# Altium project FMC_Delay_1ns_4Cha.PrjPcb (part 1 of 2)
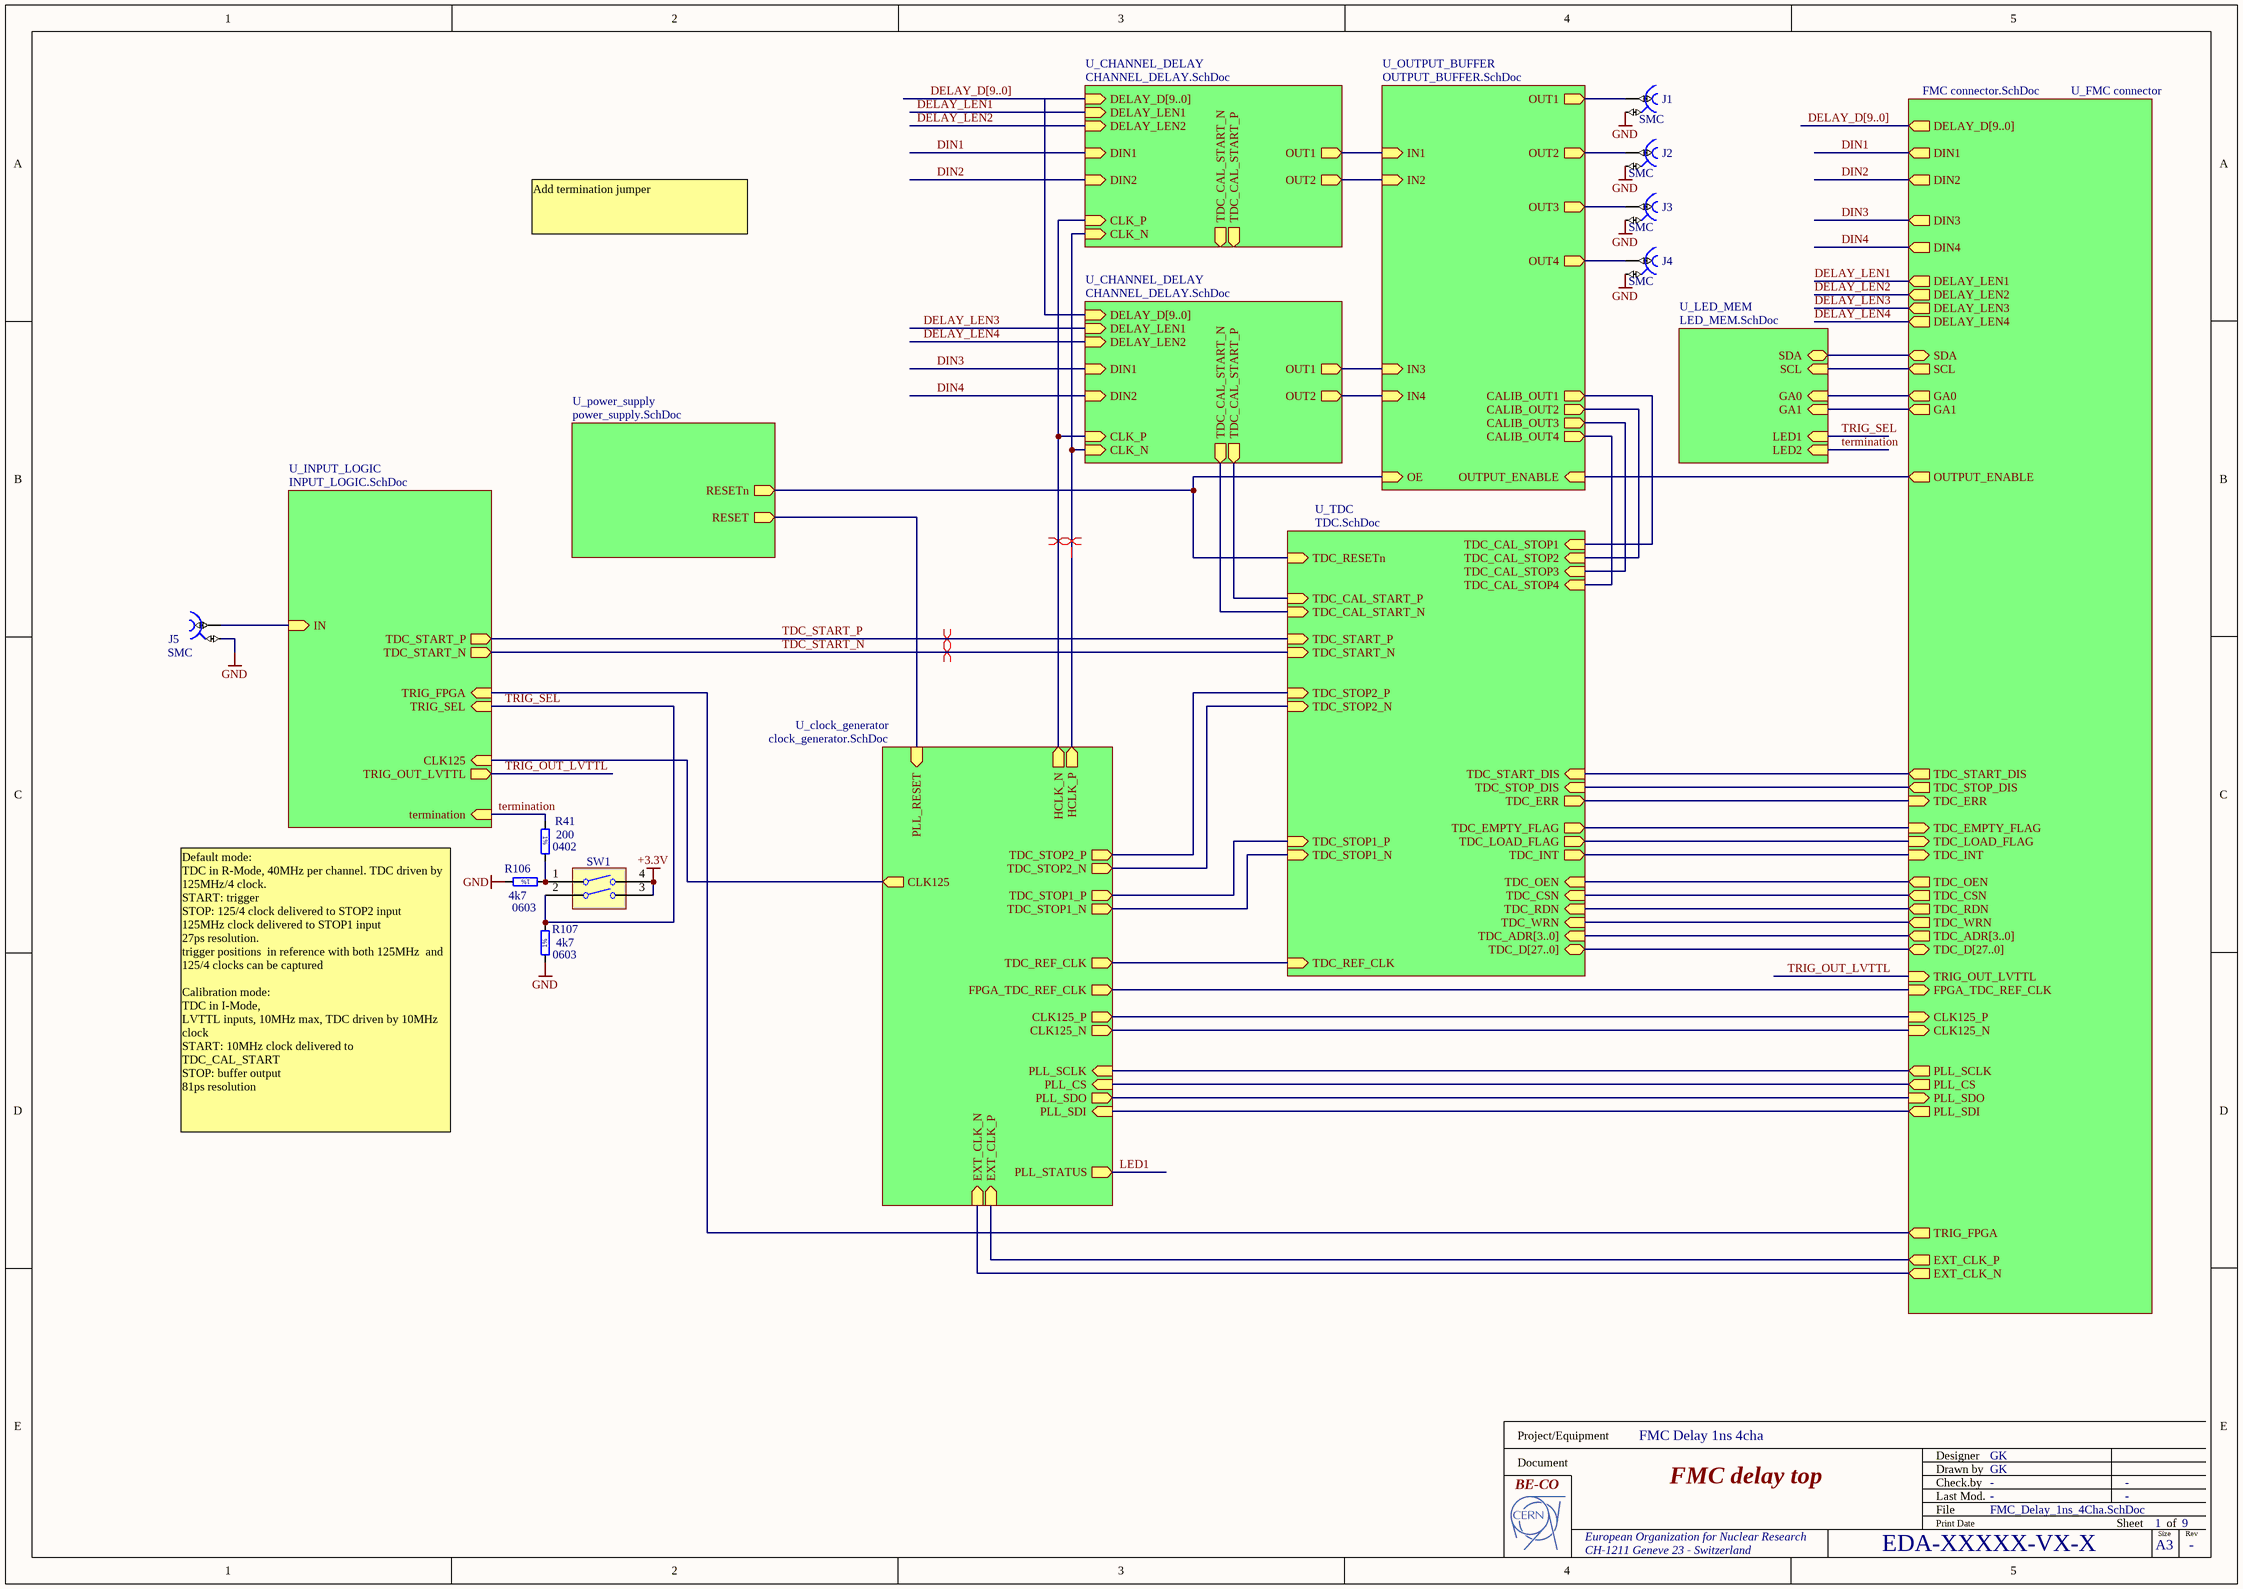
[diagram p0: FMC_Delay_1ns_4Cha.SchDoc]
6 sheets, 229 parts. Net scope: hierarchical (ports join the sheet entries above them; power ports are global).
Board file: FMC_Delay_1ns_4Cha.PcbDoc
Sheets:
  FMC_Delay_1ns_4Cha.SchDoc
    U_clock_generator = clock_generator.SchDoc
    U_FMC connector = FMC connector.SchDoc
    U_TDC = TDC.SchDoc
    U_CHANNEL_DELAY = CHANNEL_DELAY.SchDoc
    U_CHANNEL_DELAY = CHANNEL_DELAY.SchDoc
    U_INPUT_LOGIC = INPUT_LOGIC.SchDoc

## Sheet FMC_Delay_1ns_4Cha.SchDoc: FMC Delay Top
size 420 x 297 mm; CheckedBy: -; CompanyName: CERN; DrawnBy: GK; Organization: CERN; Address1: European Organization for Nuclear Research; Address2: CH-1211 Geneve 23 - Switzerland; Revision: -; SheetNumber: 1; SheetTotal: 9; EDA_Number: EDA-XXXXX-VX-X; Projet: FMC Delay 1ns 4cha; ModifiedBy: -; CheckedDate: -; DivGrp: BE-CO; Designer: GK; ModifiedDate: -; ProjectName: FMC Delay 1ns 4cha

### Parts
J1  SMC  [JOHNSON_131-6701-341]
J2  SMC  [JOHNSON_131-6701-341]
J3  SMC  [JOHNSON_131-6701-341]
J4  SMC  [JOHNSON_131-6701-341]
J5  SMC  [JOHNSON_131-6701-341]
R41  200  Case: 0402  [RESC1005X40N]
R106  4k7  Case: 0603  [RESC1608X55N]
R107  4k7  Case: 0603  [RESC1608X55N]
SW1  Switch  [SW_TYCO_1571983-1]  (value not drawn)

### Sub-sheets
U_CHANNEL_DELAY = CHANNEL_DELAY.SchDoc: DELAY_D[9..0] (in), DELAY_LEN1 (in), DELAY_LEN2 (in), DIN1 (in), DIN2 (in), CLK_N (in), CLK_P (in), OUT1 (out), OUT2 (out), TDC_CAL_START_P (out), TDC_CAL_START_N (out)
U_CHANNEL_DELAY = CHANNEL_DELAY.SchDoc: DELAY_D[9..0] (in), DELAY_LEN1 (in), DELAY_LEN2 (in), DIN1 (in), DIN2 (in), CLK_N (in), CLK_P (in), OUT1 (out), OUT2 (out), TDC_CAL_START_P (out), TDC_CAL_START_N (out)
U_clock_generator = clock_generator.SchDoc: EXT_CLK_N (in), EXT_CLK_P (in), HCLK_P (out), HCLK_N (out), PLL_CS (in), PLL_SCLK (in), PLL_SDO (out), PLL_RESET (in), PLL_SDI (in), TDC_REF_CLK (out), TDC_STOP2_P (out), TDC_STOP2_N (out), TDC_STOP1_P (out), TDC_STOP1_N (out), CLK125_N (out), CLK125_P (out), CLK125 (out), FPGA_TDC_REF_CLK (out), PLL_STATUS (out)
U_FMC connector = FMC connector.SchDoc: DIN1 (out), DIN2 (out), DIN3 (out), DIN4 (out), EXT_CLK_P (out), EXT_CLK_N (out), SDA (bidir), SCL (out), GA0 (out), GA1 (out), TDC_START_DIS (out), TDC_STOP_DIS (out), TDC_EMPTY_FLAG (in), TDC_LOAD_FLAG (in), TDC_INT (in), TDC_OEN (out), TDC_CSN (out), TDC_RDN (out), TDC_WRN (out), TDC_ADR[3..0] (out), TDC_D[27..0] (bidir), DELAY_LEN1 (out), DELAY_LEN2 (out), DELAY_LEN3 (out), DELAY_LEN4 (out), PLL_SCLK (out), PLL_CS (out), PLL_SDO (in), PLL_SDI (out), CLK125_P (in), CLK125_N (in), FPGA_TDC_REF_CLK (in), TRIG_OUT_LVTTL (in), DELAY_D[9..0] (out), TDC_ERR (in), OUTPUT_ENABLE (out), TRIG_FPGA (out)
U_INPUT_LOGIC = INPUT_LOGIC.SchDoc: TDC_START_N (out), TDC_START_P (out), IN (in), termination (in), CLK125 (in), TRIG_OUT_LVTTL (out), TRIG_FPGA (in), TRIG_SEL (in)
U_LED_MEM = LED_MEM.SchDoc (file not in this document): SDA (bidir), SCL (in), GA0 (in), GA1 (in), LED1 (in), LED2 (in)
U_OUTPUT_BUFFER = OUTPUT_BUFFER.SchDoc (file not in this document): IN1 (in), IN2 (in), IN3 (in), IN4 (in), OUT1 (out), OUT2 (out), OUT3 (out), OUT4 (out), OE (in), CALIB_OUT1 (out), CALIB_OUT2 (out), CALIB_OUT3 (out), CALIB_OUT4 (out), OUTPUT_ENABLE (in)
U_power_supply = power_supply.SchDoc (file not in this document): RESET (out), RESETn (out)
U_TDC = TDC.SchDoc: TDC_ADR[3..0] (in), TDC_START_P (in), TDC_START_N (in), TDC_STOP1_P (in), TDC_STOP1_N (in), TDC_STOP2_P (in), TDC_STOP2_N (in), TDC_CAL_STOP1 (in), TDC_CAL_STOP2 (in), TDC_CAL_STOP3 (in), TDC_CAL_STOP4 (in), TDC_START_DIS (in), TDC_STOP_DIS (in), TDC_EMPTY_FLAG (out), TDC_LOAD_FLAG (out), TDC_INT (out), TDC_REF_CLK (in), TDC_RESETn (in), TDC_D[27..0] (bidir), TDC_OEN (in), TDC_CSN (in), TDC_RDN (in), TDC_WRN (in), TDC_CAL_START_N (in), TDC_CAL_START_P (in), TDC_ERR (out)

### Nets
+3.3V: SW1.3 SW1.4
GND: J1.2 J2.2 J3.2 J4.2 J5.2 R106.2 R107.1
CLK125_N: sheet U_clock_generator/CLK125_N, sheet U_FMC connector/CLK125_N
CLK125_P: sheet U_clock_generator/CLK125_P, sheet U_FMC connector/CLK125_P
DELAY_LEN1: sheet U_FMC connector/DELAY_LEN1, sheet U_CHANNEL_DELAY/DELAY_LEN1
DELAY_LEN2: sheet U_FMC connector/DELAY_LEN2, sheet U_CHANNEL_DELAY/DELAY_LEN2
DELAY_LEN3: sheet U_FMC connector/DELAY_LEN3, sheet U_CHANNEL_DELAY/DELAY_LEN1
DELAY_LEN4: sheet U_FMC connector/DELAY_LEN4, sheet U_CHANNEL_DELAY/DELAY_LEN2
DIN1: sheet U_FMC connector/DIN1, sheet U_CHANNEL_DELAY/DIN1
DIN2: sheet U_FMC connector/DIN2, sheet U_CHANNEL_DELAY/DIN2
DIN3: sheet U_FMC connector/DIN3, sheet U_CHANNEL_DELAY/DIN1
DIN4: sheet U_FMC connector/DIN4, sheet U_CHANNEL_DELAY/DIN2
EXT_CLK_N: sheet U_clock_generator/EXT_CLK_N, sheet U_FMC connector/EXT_CLK_N
EXT_CLK_P: sheet U_clock_generator/EXT_CLK_P, sheet U_FMC connector/EXT_CLK_P
GA0: sheet U_FMC connector/GA0, sheet U_LED_MEM/GA0
GA1: sheet U_FMC connector/GA1, sheet U_LED_MEM/GA1
LED1: sheet U_clock_generator/PLL_STATUS
SCL: sheet U_FMC connector/SCL, sheet U_LED_MEM/SCL
SDA: sheet U_FMC connector/SDA, sheet U_LED_MEM/SDA
TDC_CAL_STOP1: sheet U_TDC/TDC_CAL_STOP1, sheet U_OUTPUT_BUFFER/CALIB_OUT1
TDC_CAL_STOP2: sheet U_TDC/TDC_CAL_STOP2, sheet U_OUTPUT_BUFFER/CALIB_OUT2
TDC_CAL_STOP3: sheet U_TDC/TDC_CAL_STOP3, sheet U_OUTPUT_BUFFER/CALIB_OUT3
TDC_CAL_STOP4: sheet U_TDC/TDC_CAL_STOP4, sheet U_OUTPUT_BUFFER/CALIB_OUT4
TDC_START_N: sheet U_TDC/TDC_START_N, sheet U_INPUT_LOGIC/TDC_START_N
TDC_START_P: sheet U_TDC/TDC_START_P, sheet U_INPUT_LOGIC/TDC_START_P
TDC_STOP1_N: sheet U_clock_generator/TDC_STOP1_N, sheet U_TDC/TDC_STOP1_N
TDC_STOP1_P: sheet U_clock_generator/TDC_STOP1_P, sheet U_TDC/TDC_STOP1_P
TDC_STOP2_N: sheet U_clock_generator/TDC_STOP2_N, sheet U_TDC/TDC_STOP2_N
TDC_STOP2_P: sheet U_clock_generator/TDC_STOP2_P, sheet U_TDC/TDC_STOP2_P
termination: R41.1 ; sheet U_LED_MEM/LED2, sheet U_INPUT_LOGIC/termination
TRIG_OUT_LVTTL: sheet U_FMC connector/TRIG_OUT_LVTTL, sheet U_INPUT_LOGIC/TRIG_OUT_LVTTL
TRIG_SEL: R107.2 SW1.2 ; sheet U_LED_MEM/LED1, sheet U_INPUT_LOGIC/TRIG_SEL
NetF4_1: J5.1 ; sheet U_INPUT_LOGIC/IN
NetIC1A_6: sheet U_CHANNEL_DELAY/OUT2, sheet U_OUTPUT_BUFFER/IN2
NetIC1A_7: sheet U_CHANNEL_DELAY/OUT1, sheet U_OUTPUT_BUFFER/IN1
NetIC1B_6: sheet U_CHANNEL_DELAY/OUT2, sheet U_OUTPUT_BUFFER/IN4
NetIC1B_7: sheet U_CHANNEL_DELAY/OUT1, sheet U_OUTPUT_BUFFER/IN3
NetIC2B_4: sheet U_TDC/TDC_CAL_START_P, sheet U_CHANNEL_DELAY/TDC_CAL_START_P
NetIC2B_5: sheet U_TDC/TDC_CAL_START_N, sheet U_CHANNEL_DELAY/TDC_CAL_START_N
NetIC3A_3: sheet U_clock_generator/HCLK_N, sheet U_CHANNEL_DELAY/CLK_P, sheet U_CHANNEL_DELAY/CLK_P
NetIC3A_4: sheet U_clock_generator/HCLK_P, sheet U_CHANNEL_DELAY/CLK_N, sheet U_CHANNEL_DELAY/CLK_N
NetIC4_16: sheet U_clock_generator/PLL_SCLK, sheet U_FMC connector/PLL_SCLK
NetIC4_17: sheet U_clock_generator/PLL_CS, sheet U_FMC connector/PLL_CS
NetIC4_22: sheet U_clock_generator/PLL_SDI, sheet U_FMC connector/PLL_SDI
NetIC4_23: sheet U_clock_generator/PLL_RESET, sheet U_power_supply/RESET
NetIC4_33: sheet U_clock_generator/CLK125, sheet U_INPUT_LOGIC/CLK125
NetIC4_35: sheet U_clock_generator/TDC_REF_CLK, sheet U_TDC/TDC_REF_CLK
NetIC4_36: sheet U_clock_generator/FPGA_TDC_REF_CLK, sheet U_FMC connector/FPGA_TDC_REF_CLK
NetIC8_4: sheet U_FMC connector/TDC_START_DIS, sheet U_TDC/TDC_START_DIS
NetIC8_5: sheet U_FMC connector/TDC_STOP_DIS, sheet U_TDC/TDC_STOP_DIS
NetIC8_13: sheet U_FMC connector/TDC_WRN, sheet U_TDC/TDC_WRN
NetIC8_14: sheet U_FMC connector/TDC_CSN, sheet U_TDC/TDC_CSN
NetIC8_15: sheet U_FMC connector/TDC_RDN, sheet U_TDC/TDC_RDN
NetIC8_63: sheet U_FMC connector/TDC_OEN, sheet U_TDC/TDC_OEN
NetIC8_67: sheet U_power_supply/RESETn, sheet U_TDC/TDC_RESETn, sheet U_OUTPUT_BUFFER/OE
NetIC17_1: sheet U_FMC connector/TRIG_FPGA, sheet U_INPUT_LOGIC/TRIG_FPGA
NetJ1_1: J1.1 ; sheet U_OUTPUT_BUFFER/OUT1
NetJ2_1: J2.1 ; sheet U_OUTPUT_BUFFER/OUT2
NetJ3_1: J3.1 ; sheet U_OUTPUT_BUFFER/OUT3
NetJ4_1: J4.1 ; sheet U_OUTPUT_BUFFER/OUT4
NetJ6_d15: sheet U_FMC connector/OUTPUT_ENABLE, sheet U_OUTPUT_BUFFER/OUTPUT_ENABLE
NetJ6_d18: sheet U_clock_generator/PLL_SDO, sheet U_FMC connector/PLL_SDO
NetJ6_h26: sheet U_FMC connector/TDC_LOAD_FLAG, sheet U_TDC/TDC_LOAD_FLAG
NetJ6_h28: sheet U_FMC connector/TDC_EMPTY_FLAG, sheet U_TDC/TDC_EMPTY_FLAG
NetJ6_h31: sheet U_FMC connector/TDC_INT, sheet U_TDC/TDC_INT
NetJ6_h32: sheet U_FMC connector/TDC_ERR, sheet U_TDC/TDC_ERR
NetR41_2: R41.2 R106.1 SW1.1

### Buses and harness runs
bus DELAY_D[9..0] = sheet U_CHANNEL_DELAY/DELAY_D[9..0]
bus DELAY_D[9..0] = sheet U_FMC connector/DELAY_D[9..0]
bus sheet U_FMC connector/TDC_ADR[3..0] = sheet U_TDC/TDC_ADR[3..0]
bus sheet U_FMC connector/TDC_D[27..0] = sheet U_TDC/TDC_D[27..0]

### Layout directives
differential pair: NetIC3A_3, NetIC3A_4, TDC_START_N, TDC_START_P

### Notes on the sheet
- Add termination jumper
- Default mode:
  TDC in R-Mode, 40MHz per channel. TDC driven by 125MHz/4 clock.
  START: trigger
  STOP: 125/4 clock delivered to STOP2 input
  125MHz clock delivered to STOP1 input
  27ps resolution.
  trigger positions  in reference with both 125MHz  and 125/4 clocks can be captured
  Calibration mode:
  TDC in I-Mode,
  LVTTL inputs, 10MHz max, TDC driven by 10MHz clock
  START: 10MHz clock delivered to TDC_CAL_START
  STOP: buffer output
  81ps resolution
- Project/Equipment
- Document
- FMC delay top
- Designer
- Drawn by
- Check.by
- File
- Last Mod.
- Print Date
- Sheet
- Size
- A3
- of
- Rev
- (in symbol R0402_200R_1%_0.0625W_100PPM) 1%
- (in symbol R0603_4K7_1%_0.1W_100PPM) 1%

### Library data of the parts
J1-J5 = JOHNSON_131-6701-341: Part Description: SMC 50 Ohm Right Angle Bulkhead Jack Receptacle; Manufacturer Part Number: 142-0701-873; Table: Miscellaneous; Part Number: JOHNSON_131-6701-341; Component Kind: Standard; Component Type: Standard; Pin Count: 2; Family: SMC; Mounted: Yes; Socket: No; SMD: No; Status: None; Manufacturer: JOHNSON; ComponentHeight: 7.67mm; HelpURL: \\cern.ch\dfs\Applications\Altium\Datasheets\JOHNSON_131-6701-341.pdf; Author: CERN DEM JLC; CreateDate: 16.02.2010; LatestRevisionDate: 16.02.2010
R41 = R0402_200R_1%_0.0625W_100PPM: Resistor - 1%; Part Description: General Purpose Thick Film Chip Resistor; Manufacturer: GENERIC; Manufacturer1 Part Number: 232270672001; TC: ±100ppm/°C; Table: Resistors SMD; Part Number: R0402_200R_1%_0.0625W_100PPM; Component Kind: Standard; Component Type: Standard; Pin Count: 2; Value: 200; Status: Not recommended; Power: 0.0625W; Tolerance: ±1%; Manufacturer Part Number: R0402_200R_1%_0.0625W_100PPM; Mounted: Yes; Socket: No; SMD: Yes; Manufacturer1 Example: PHYCOMP; Manufacturer1 ComponentHeight: 0.4mm; HelpURL: \\cern.ch\dfs\Applications\Altium\Datasheets\R0402_Phycomp_RC0402.pdf; Author: CERN DEM JLC; CreateDate: 12/3/2007; LatestRevisionDate: 3/13/2008
R106 R107 = R0603_4K7_1%_0.1W_100PPM: Resistor - 1%; Part Description: General Purpose Thick Film Chip Resistor; Manufacturer: GENERIC; Manufacturer1 Part Number: NRC06F4701TRF; Power: 0.1W; TC: ±100ppm/°C; Table: Resistors SMD; Part Number: R0603_4K7_1%_0.1W_100PPM; Component Kind: Standard; Component Type: Standard; Pin Count: 2; Value: 4k7; Status: Preferred; Tolerance: ±1%; Manufacturer Part Number: R0603_4K7_1%_0.1W_100PPM; Mounted: Yes; Socket: No; SMD: Yes; Manufacturer1 Example: NIC COMPONENT; Manufacturer1 ComponentHeight: 0.55mm; HelpURL: \\cern.ch\dfs\Applications\Altium\Datasheets\R0603_NIC_NRC.pdf; Author: CERN DEM JLC; CreateDate: 2007-12-03; LatestRevisionDate: 2008-03-13
SW1 = SW_TYCO_1571983-1: 2 Ways SPST DIP Switch; Part Description: 2 Way SPST SMD DIP Switch, Latched, Contact Rating 0.025A 24VDC; Manufacturer: TYCO; Manufacturer Part Number: 1571983-1 or GDH02S04; Table: Switches; Part Number: SW_TYCO_1571983-1; Component Kind: Standard; Component Type: Standard; Pin Count: 4; PackageDescription: Pitch 1.27mm,  Body3.66x6.2mm, 2 Ways SPST Surface-Mount DIP Switch, TYCO GDH Serie; Family: Switch; Mounted: Yes; Socket: No; SMD: Yes; Status: None; ComponentHeight: 2.31mm; HelpURL: \\cern.ch\dfs\Applications\Altium\Datasheets\SW_TYCO_1571983-1.pdf; Author: CERN DEM JLC; CreateDate: 2009-01-08; LatestRevisionDate: 2009-01-08

## Sheet clock_generator.SchDoc: ADC clock generator
size 297 x 209 mm; CheckedBy: -; CompanyName: CERN; Organization: CERN; Address1: European Organization for Nuclear Research; Address2: CH-1211 Geneve 23 - Switzerland; DocumentNumber: 5; Revision: -; SheetNumber: 2; SheetTotal: 9; EDA_Number: EDA-XXXXX-VX-X; Projet: FMC Delay 1ns 4cha; ModifiedBy: -; CheckedDate: -; DivGrp: BE-CO; Designer: GK; ModifiedDate: -
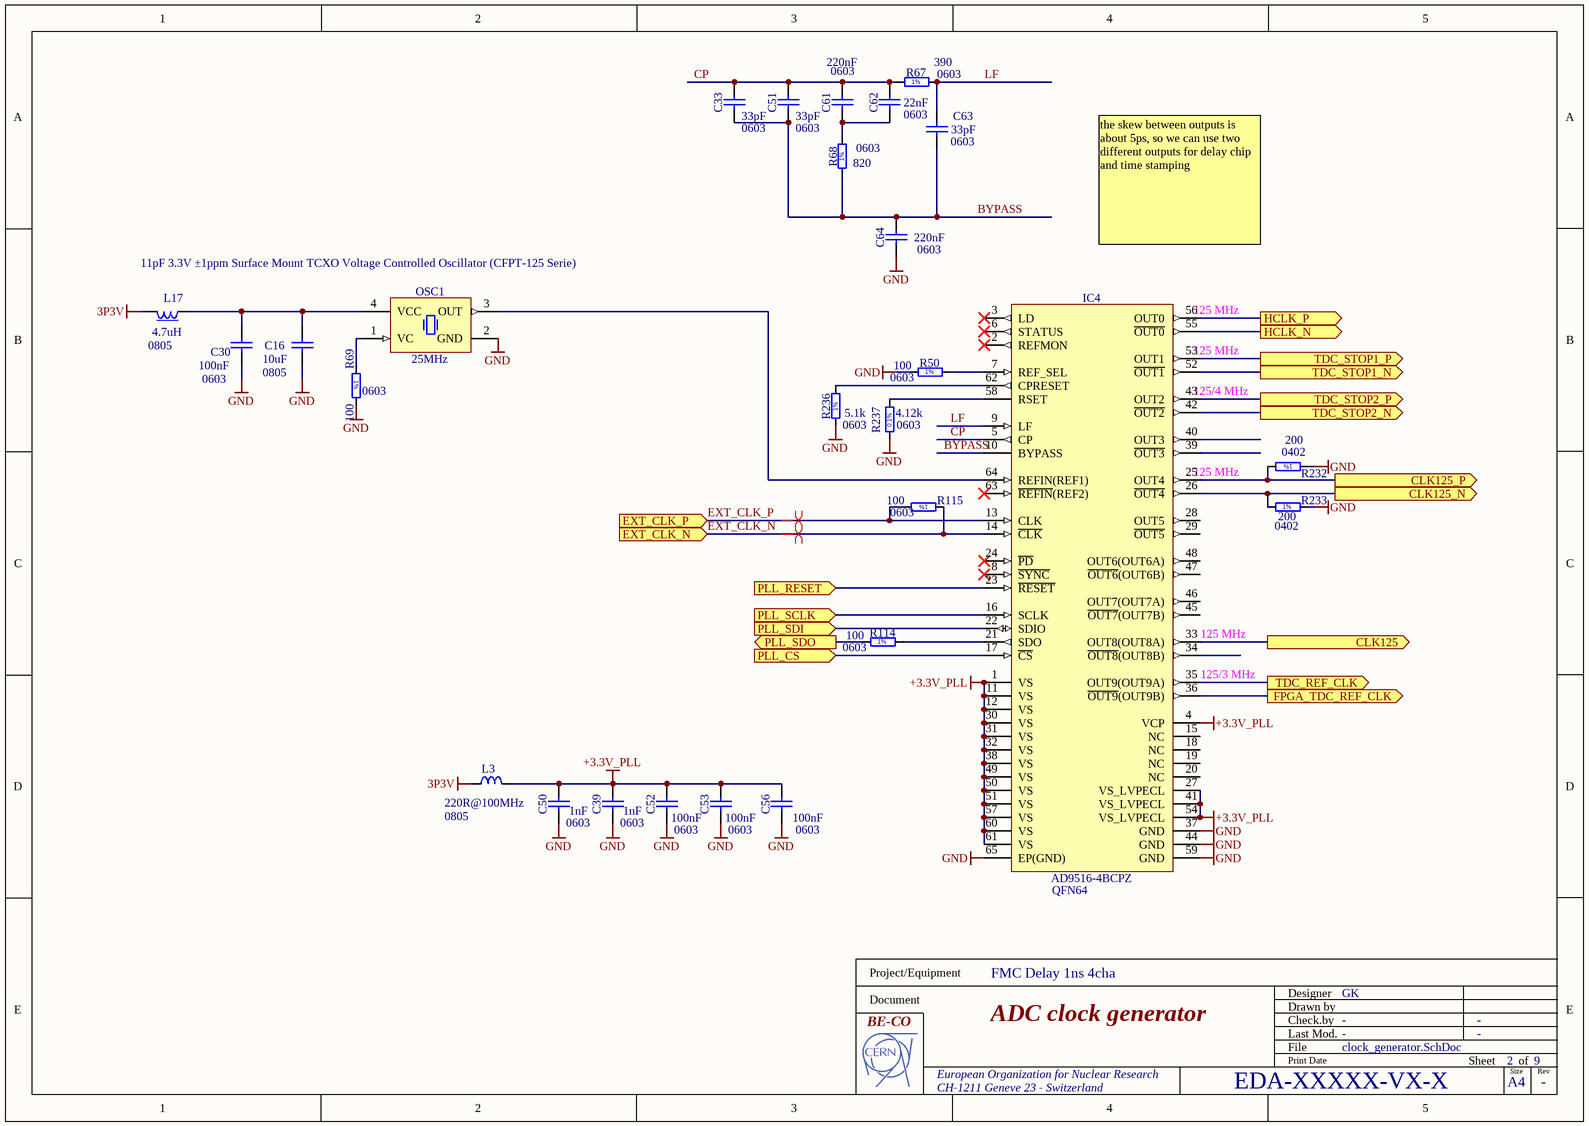
[diagram p1: clock_generator.SchDoc]

### Parts
C16  10uF  Case: 0805  [CAPC2012X135N]
C30  100nF  Case: 0603  [CAPC1608X87N]
C33  33pF  Case: 0603  [CAPC1608X87N]
C39  1nF  Case: 0603  [CAPC1608X87N]
C50  1nF  Case: 0603  [CAPC1608X87N]
C51  33pF  Case: 0603  [CAPC1608X87N]
C52  100nF  Case: 0603  [CAPC1608X87N]
C53  100nF  Case: 0603  [CAPC1608X87N]
C56  100nF  Case: 0603  [CAPC1608X87N]
C61  220nF  Case: 0603  [CAPC1608X87N]
C62  22nF  Case: 0603  [CAPC1608X87N]
C63  33pF  Case: 0603  [CAPC1608X87N]
C64  220nF  Case: 0603  [CAPC1608X87N]
IC4  AD9516-4BCPZ  Case: QFN64  [QFN50P900X900X100-65N-S635]
L3  220R@100MHz  Case: 0805  [INDC2012X105N]
L17  4.7uH  Case: 0805  [INDC2012X145N]
OSC1  25MHz  Part Description: 11pF 3.3V ±1ppm Surface Mount TCXO Voltage Controlled Oscillator (CFPT-125 Serie)  [OSC_RAKON_IVT3200C]
R50  100  Case: 0603  [RESC1608X55N]
R67  390  Case: 0603  [RESC1608X55N]
R68  820  Case: 0603  [RESC1608X55N]
R69  100  Case: 0603  [RESC1608X55N]
R114  100  Case: 0603  [RESC1608X55N]
R115  100  Case: 0603  [RESC1608X55N]
R232  200  Case: 0402  [RESC1005X40N]
R233  200  Case: 0402  [RESC1005X40N]
R236  5.1k  Case: 0603  [RESC1608X55N]
R237  4.12k  Case: 0603  [RESC1608X55N]

### Ports
CLK125 (out), CLK125_N (out), CLK125_P (out), EXT_CLK_N (in), EXT_CLK_P (in), FPGA_TDC_REF_CLK (out), HCLK_N (out), HCLK_P (out), PLL_CS (in), PLL_RESET (in), PLL_SCLK (in), PLL_SDI (in), PLL_SDO (out), TDC_REF_CLK (out), TDC_STOP1_N (out), TDC_STOP1_P (out), TDC_STOP2_N (out), TDC_STOP2_P (out)

### Nets
3P3V: L3.1 L17.2  [project net +3.3V]
+3.3V_PLL: C39.2 C50.2 C52.2 C53.2 C56.2 IC4.1(VS) IC4.4(VCP) IC4.11(VS) IC4.12(VS) IC4.27(VS_LVPECL) IC4.30(VS) IC4.31(VS) IC4.32(VS) IC4.38(VS) IC4.41(VS_LVPECL) IC4.49(VS) IC4.50(VS) IC4.51(VS) IC4.54(VS_LVPECL) IC4.57(VS) IC4.60(VS) IC4.61(VS) L3.2
GND: C16.1 C30.1 C39.1 C50.1 C52.1 C53.1 C56.1 C64.1 IC4.37(GND) IC4.44(GND) IC4.59(GND) IC4.65(EP(GND)) OSC1.2(GND) R50.1 R69.2 R232.1 R233.2 R236.1 R237.1
BYPASS: C33.1 C51.1 C63.1 C64.2 IC4.10(BYPASS) R68.1
CLK125_N: IC4.26(~{OUT4}) R233.1 ; port CLK125_N
CLK125_P: IC4.25(OUT4) R232.2 ; port CLK125_P
CP: C33.2 C51.2 C61.2 C62.2 IC4.5(CP) R67.1
EXT_CLK_N: IC4.14(~{CLK}) R115.1 ; port EXT_CLK_N
EXT_CLK_P: IC4.13(CLK) R115.2 ; port EXT_CLK_P
LF: C63.2 IC4.9(LF) R67.2
TDC_STOP1_N: IC4.52(~{OUT1}) ; port TDC_STOP1_N
TDC_STOP1_P: IC4.53(OUT1) ; port TDC_STOP1_P
TDC_STOP2_N: IC4.42(~{OUT2}) ; port TDC_STOP2_N
TDC_STOP2_P: IC4.43(OUT2) ; port TDC_STOP2_P
NetC16_2: C16.2 C30.2 L17.1 OSC1.4(VCC)
NetC61_1: C61.1 C62.1 R68.2
NetIC3A_3: IC4.55(~{OUT0}) ; port HCLK_N
NetIC3A_4: IC4.56(OUT0) ; port HCLK_P
NetIC4_7: IC4.7(REF_SEL) R50.2
NetIC4_16: IC4.16(SCLK) ; port PLL_SCLK
NetIC4_17: IC4.17(~{CS}) ; port PLL_CS
NetIC4_21: IC4.21(SDO) R114.2
NetIC4_22: IC4.22(SDIO) ; port PLL_SDI
NetIC4_23: IC4.23(~{RESET}) ; port PLL_RESET
NetIC4_33: IC4.33(OUT8(OUT8A)) ; port CLK125
NetIC4_35: IC4.35(OUT9(OUT9A)) ; port TDC_REF_CLK
NetIC4_36: IC4.36(~{OUT9}(OUT9B)) ; port FPGA_TDC_REF_CLK
NetIC4_58: IC4.58(RSET) R237.2
NetIC4_62: IC4.62(CPRESET) R236.2
NetIC4_64: IC4.64(REFIN(REF1)) OSC1.3(OUT)
NetJ6_d18: R114.1 ; port PLL_SDO
NetOSC1_1: OSC1.1(VC) R69.1

Not connected (* = marked no-connect by the designer): IC4 2(REFMON)* 3(LD)* 6(STATUS)* 8(~{SYNC})* 15(NC) 18(NC) 19(NC) 20(NC) 24(~{PD})* 28(OUT5) 29(~{OUT5}) 34(~{OUT8}(OUT8B)) 39(~{OUT3}) 40(OUT3) 45(~{OUT7}(OUT7B)) 46(OUT7(OUT7A)) 47(~{OUT6}(OUT6B)) 48(OUT6(OUT6A)) 63(~{REFIN}(REF2))*

### Layout directives
differential pair: EXT_CLK_N, EXT_CLK_P

### Notes on the sheet
- the skew between outputs is about 5ps, so we can use two different outputs for delay chip and time stamping
- (near IC4) 125 MHz
- (near IC4) 125/4 MHz
- (near IC4) 125/3 MHz
- Project/Equipment
- Document
- Designer
- Drawn by
- Check.by
- File
- Last Mod.
- Print Date
- Sheet
- Size
- A4
- of
- Rev
- (in symbol R0402_200R_1%_0.0625W_100PPM) 1%
- (in symbol R0603_4K12_0.1%_0.063W_10PPM) 0.1%
- (in symbol R0603_5K1_1%_0.1W_100PPM) 1%
- (in symbol R0603_100R_1%_0.1W_100PPM) 1%
- (in symbol R0603_390R_1%_0.1W_100PPM) 1%
- (in symbol R0603_820R_1%_0.1W_100PPM) 1%

### Library data of the parts
C16 = CC0805_10UF_16V_10%_X5R: Non-polarised capacitor; Part Description: SMD Multilayer Chip Ceramic Capacitor; Manufacturer: GENERIC; Manufacturer1 Part Number: C0805C106K4PAC; Voltage: 16V; TC: X5R; Tolerance: ±10%; Table: Capacitors SMD; Part Number: CC0805_10UF_16V_10%_X5R; Component Kind: Standard; Component Type: Standard; Pin Count: 2; Value: 10uF; Status: Preferred; Manufacturer Part Number: CC0805_10UF_16V_10%_X5R; Mounted: Yes; Socket: No; SMD: Yes; Manufacturer1 Example: KEMET; Manufacturer1 ComponentHeight: 1.4mm; HelpURL: \\cern.ch\dfs\Applications\Altium\Datasheets\CC1206_X5R_KEMET.pdf; Author: CERN DEM JLC; CreateDate: 03.12.2007; LatestRevisionDate: 03.12.2007
C30 = CC0603_100NF_50V_10%_X7R: Non-polarised capacitor; Manufacturer1 Part Number: 223858615649; Manufacturer: GENERIC; Part Description: SMD Multilayer Chip Ceramic Capacitor; Table: Capacitors SMD; TC: X7R; Tolerance: ±10%; Voltage: 50V; Author: CERN DEM JLC; Component Type: Standard; CreateDate: 03.12.2007; HelpURL: \\cern.ch\dfs\Applications\Altium\Datasheets\CC0603_X7R_PHYCOMP.pdf; LatestRevisionDate: 03.12.2007; Manufacturer1 ComponentHeight: 0.87mm; Manufacturer1 Example: PHYCOMP; Manufacturer Part Number: CC0603_100NF_50V_10%_X7R; Mounted: Yes; Pin Count: 2; SMD: Yes; Socket: No; Status: Preferred; Value: 100nF; Part Number: CC0603_100NF_50V_10%_X7R; Component Kind: Standard
C33 C51 C63 = CC0603_33PF_50V_5%_NP0: Non-polarised capacitor; Part Description: SMD Multilayer Chip Ceramic Capacitor; Manufacturer: GENERIC; Manufacturer1 Part Number: 223886715339; Voltage: 50V; TC: NP0; Tolerance: ±5%; Table: Capacitors SMD; Part Number: CC0603_33PF_50V_5%_NP0; Component Kind: Standard; Component Type: Standard; Pin Count: 2; Value: 33pF; Status: Preferred; Manufacturer Part Number: CC0603_33PF_50V_5%_NP0; Mounted: Yes; Socket: No; SMD: Yes; Manufacturer1 Example: PHYCOMP; Manufacturer1 ComponentHeight: 0.87mm; HelpURL: \\cern.ch\dfs\Applications\Altium\Datasheets\CC0603_NP0_PHYCOMP.pdf; Author: CERN DEM JLC; CreateDate: 2007-12-03; LatestRevisionDate: 2007-12-03
C39 C50 = CC0603_1NF_50V_10%_X7R: Non-polarised capacitor; Part Description: SMD Multilayer Chip Ceramic Capacitor; Manufacturer: GENERIC; Manufacturer1 Part Number: 223858615623; Voltage: 50V; TC: X7R; Tolerance: ±10%; Table: Capacitors SMD; Part Number: CC0603_1NF_50V_10%_X7R; Component Kind: Standard; Component Type: Standard; Pin Count: 2; Value: 1nF; Status: Preferred; Manufacturer Part Number: CC0603_1NF_50V_10%_X7R; Mounted: Yes; Socket: No; SMD: Yes; Manufacturer1 Example: PHYCOMP; Manufacturer1 ComponentHeight: 0.87mm; HelpURL: \\cern.ch\dfs\Applications\Altium\Datasheets\CC0603_X7R_PHYCOMP.pdf; Author: CERN DEM JLC; CreateDate: 2007-12-03; LatestRevisionDate: 2007-12-03
C52 C53 C56 = CC0603_100NF_50V_10%_X7R: Non-polarised capacitor; Part Description: SMD Multilayer Chip Ceramic Capacitor; Manufacturer: GENERIC; Manufacturer1 Part Number: 223858615649; Voltage: 50V; TC: X7R; Tolerance: ±10%; Table: Capacitors SMD; Part Number: CC0603_100NF_50V_10%_X7R; Component Kind: Standard; Component Type: Standard; Pin Count: 2; Value: 100nF; Status: Preferred; Manufacturer Part Number: CC0603_100NF_50V_10%_X7R; Mounted: Yes; Socket: No; SMD: Yes; Manufacturer1 Example: PHYCOMP; Manufacturer1 ComponentHeight: 0.87mm; HelpURL: \\cern.ch\dfs\Applications\Altium\Datasheets\CC0603_X7R_PHYCOMP.pdf; Author: CERN DEM JLC; CreateDate: 2007-12-03; LatestRevisionDate: 2007-12-03
C61 C64 = CC0603_220NF_16V_+80%-20%_Y5V: Non-polarised capacitor; Part Description: SMD Multilayer Chip Ceramic Capacitor; Manufacturer: GENERIC; Manufacturer1 Part Number: 223878619854; Voltage: 16V; TC: Y5V; Table: Capacitors SMD; Part Number: CC0603_220NF_16V_+80%-20%_Y5V; Component Kind: Standard; Component Type: Standard; Pin Count: 2; Value: 220nF; Status: Preferred; Tolerance: +80% -20%; Manufacturer Part Number: CC0603_220NF_16V_+80%-20%_Y5V; Mounted: Yes; Socket: No; SMD: Yes; Manufacturer1 Example: PHYCOMP; Manufacturer1 ComponentHeight: 0.87mm; HelpURL: \\cern.ch\dfs\Applications\Altium\Datasheets\CC0603_Y5V_PHYCOMP.pdf; Author: CERN DEM JLC; CreateDate: 2007-12-03; LatestRevisionDate: 2007-12-03
C62 = CC0603_22NF_50V_10%_X7R: Non-polarised capacitor; Part Description: SMD Multilayer Chip Ceramic Capacitor; Manufacturer: GENERIC; Manufacturer1 Part Number: 223858615641; Voltage: 50V; TC: X7R; Tolerance: ±10%; Table: Capacitors SMD; Part Number: CC0603_22NF_50V_10%_X7R; Component Kind: Standard; Component Type: Standard; Pin Count: 2; Value: 22nF; Status: Preferred; Manufacturer Part Number: CC0603_22NF_50V_10%_X7R; Mounted: Yes; Socket: No; SMD: Yes; Manufacturer1 Example: PHYCOMP; Manufacturer1 ComponentHeight: 0.87mm; HelpURL: \\cern.ch\dfs\Applications\Altium\Datasheets\CC0603_X7R_PHYCOMP.pdf; Author: CERN DEM JLC; CreateDate: 2007-12-03; LatestRevisionDate: 2007-12-03
IC4 = AD9516-4BCPZ: 14-Output Clock Generator with Integrated 1.6 GHz VCO; Manufacturer: ANALOG DEVICES; Table: Logic; Part Number: AD9516-4BCPZ; Component Kind: Standard; Component Type: Standard; Device: AD9516-4BCPZ; PackageDescription: QFN,0.50mm pitch,square;64 pin,9.00mm L X 9.00mm W X 1.00mm H body (6.35mm X 6.35mm thermal tab), IPC Medium Density; Part Description: 14-Output Clock Generator with Integrated 1.6 GHz VCO; Manufacturer Part Number: AD9516-4BCPZ; Pin Count: 65; Mounted: Yes; Socket: No; SMD: Yes; ComponentHeight: 1.0mm; HelpURL: \\cern.ch\dfs\Applications\Altium\Datasheets\AD9516-4BCPZ.pdf; Author: CERN DEM JLC; CreateDate: 2010-01-18; LatestRevisionDate: 2010-01-18
L3 = IND0805_MURATA_BLM21PG221SN1D: Inductor; Part Description: SMD EMIFIL Suppression Chip Bead Ferrite; Manufacturer: MURATA; Power: 2A; Resistance: 0.05R; Tolerance: ±25%; Table: Inductors SMD; Part Number: IND0805_MURATA_BLM21PG221SN1D; Component Kind: Standard; Component Type: Standard; Pin Count: 2; Value: 220R@100MHz; Status: None; Manufacturer Part Number: BLM21PG221SN1D; Mounted: Yes; Socket: No; SMD: Yes; ComponentHeight: 1.05mm; HelpURL: \\cern.ch\dfs\Applications\Altium\Datasheets\IND0402_MURATA_BLM21P.pdf; Author: CERN DEM JLC; CreateDate: 2010-01-25; LatestRevisionDate: 2010-01-25
L17 = IND0805_4.7UH_20%_KEMET_L-DWI: Inductor With Magnetic core; Part Description: Wire Wound Chip Inductors; Manufacturer: KEMET; Manufacturer Part Number: L0805C4R7MDWIT; Power: 360mA; Resistance: 0.5R; Tolerance: ±20%; Table: Inductors SMD; Part Number: IND0805_4.7UH_20%_KEMET_L-DWI; Component Kind: Standard; Component Type: Standard; Pin Count: 2; Value: 4.7uH; Status: None; Mounted: Yes; Socket: No; SMD: Yes; ComponentHeight: 1.45mm; HelpURL: \\cern.ch\dfs\Applications\Altium\Datasheets\IND0805_KEMET_L-DWI .pdf; Author: CERN DEM JLC; CreateDate: 26.01.2010; LatestRevisionDate: 26.01.2010
OSC1 = OSC_25MHZ_RAKON_IVT3205CR: Oscillator 4 pins 1=Voltage Control 2=GND 3=OUT 4=VCC; Manufacturer: RAKON; Manufacturer Part Number: IVT3205CR 25.0 MHz; Table: Crystals & Oscillators; Part Number: OSC_25MHZ_RAKON_IVT3205CR; Component Kind: Standard; Component Type: Standard; PackageDescription: Oscillator IVT3200C Serie, corner concave; 4 pin, 2.50mm L X 3.2mm W X 1.1mm H; Value: 25MHz; Pin Count: 4; Mounted: Yes; Socket: No; SMD: Yes; ComponentHeight: 1.1mm; HelpURL: \\cern.ch\dfs\Applications\Altium\Datasheets\OSC_RAKON_IVT3200C.pdf; Author: CERN DEM JLC; CreateDate: 08/02/2010; LatestRevisionDate: 08/02/2010
R50 R69 R114 R115 = R0603_100R_1%_0.1W_100PPM: Resistor - 1%; Part Description: General Purpose Thick Film Chip Resistor; Manufacturer: GENERIC; Manufacturer1 Part Number: NRC06F4700TRF; Power: 0.1W; TC: ±100ppm/°C; Table: Resistors SMD; Part Number: R0603_100R_1%_0.1W_100PPM; Component Kind: Standard; Component Type: Standard; Pin Count: 2; Value: 100; Status: Preferred; Tolerance: ±1%; Manufacturer Part Number: R0603_100R_1%_0.1W_100PPM; Mounted: Yes; Socket: No; SMD: Yes; Manufacturer1 Example: NIC COMPONENT; Manufacturer1 ComponentHeight: 0.55mm; HelpURL: \\cern.ch\dfs\Applications\Altium\Datasheets\R0603_NIC_NRC.pdf; Author: CERN DEM JLC; CreateDate: 2007-12-03; LatestRevisionDate: 2008-03-13
R67 = R0603_390R_1%_0.1W_100PPM: Resistor - 1%; Part Description: General Purpose Thick Film Chip Resistor; Manufacturer: GENERIC; Manufacturer1 Part Number: NRC06F3900TRF; Power: 0.1W; TC: ±100ppm/°C; Table: Resistors SMD; Part Number: R0603_390R_1%_0.1W_100PPM; Component Kind: Standard; Component Type: Standard; Pin Count: 2; Value: 390; Status: Preferred; Tolerance: ±1%; Manufacturer Part Number: R0603_390R_1%_0.1W_100PPM; Mounted: Yes; Socket: No; SMD: Yes; Manufacturer1 Example: NIC COMPONENT; Manufacturer1 ComponentHeight: 0.55mm; HelpURL: \\cern.ch\dfs\Applications\Altium\Datasheets\R0603_NIC_NRC.pdf; Author: CERN DEM JLC; CreateDate: 2007-12-03; LatestRevisionDate: 2008-03-13
R68 = R0603_820R_1%_0.1W_100PPM: Resistor - 1%; Part Description: General Purpose Thick Film Chip Resistor; Manufacturer: GENERIC; Manufacturer1 Part Number: NRC06F8200TRF; Power: 0.1W; TC: ±100ppm/°C; Table: Resistors SMD; Part Number: R0603_820R_1%_0.1W_100PPM; Component Kind: Standard; Component Type: Standard; Pin Count: 2; Value: 820; Status: Preferred; Tolerance: ±1%; Manufacturer Part Number: R0603_820R_1%_0.1W_100PPM; Mounted: Yes; Socket: No; SMD: Yes; Manufacturer1 Example: NIC COMPONENT; Manufacturer1 ComponentHeight: 0.55mm; HelpURL: \\cern.ch\dfs\Applications\Altium\Datasheets\R0603_NIC_NRC.pdf; Author: CERN DEM JLC; CreateDate: 2007-12-03; LatestRevisionDate: 2008-03-13
R232 R233 = R0402_200R_1%_0.0625W_100PPM: as R41 on sheet FMC_Delay_1ns_4Cha; Part Number: R0402_200R_1%_0.0625W_100PPM; Component Kind: Standard; Component Type: Standard; Pin Count: 2; Value: 200; Status: Not recommended; Power: 0.0625W; Tolerance: ±1%; Manufacturer Part Number: R0402_200R_1%_0.0625W_100PPM; Mounted: Yes; Socket: No; SMD: Yes; Manufacturer1 Example: PHYCOMP; Manufacturer1 ComponentHeight: 0.4mm; HelpURL: \\cern.ch\dfs\Applications\Altium\Datasheets\R0402_Phycomp_RC0402.pdf; Author: CERN DEM JLC; CreateDate: 12/3/2007; LatestRevisionDate: 3/13/2008
R236 = R0603_5K1_1%_0.1W_100PPM: Resistor - 1%; Part Description: General Purpose Thick Film Chip Resistor; Manufacturer: GENERIC; Manufacturer1 Part Number: NRC06F5101TRF; Manufacturer1 Datasheet: \\cern.ch\dfs\Applications\Altium\Datasheets\R0603_NIC_NRC.pdf; Value: 5k1; Power: 0.1W; TC: ±100ppm/°C; Table: Resistors SMD; Part Number: R0603_5K1_1%_0.1W_100PPM; Component Kind: Standard; Component Type: Standard; Designator: Resistor - 1%; Library Reference: Resistor - 1%; Pin Count: 2; Status: Preferred; Tolerance: ±1%; Manufacturer Part Number: R0603_5K1_1%_0.1W_100PPM; Mounted: Yes; Socket: No; SMD: Yes; Manufacturer1 Example: NIC COMPONENT; Manufacturer1 ComponentHeight: 0.55mm; HelpURL: \\cern.ch\dfs\Applications\Altium\Datasheets\R0603_NIC_NRC.pdf; Author: CERN DEM JLC; CreateDate: 2007-12-03; LatestRevisionDate: 2008-03-13
R237 = R0603_4K12_0.1%_0.063W_10PPM: Resistor - 0.1%; Part Description: Thin Film Chip Resistor; Manufacturer: GENERIC; Manufacturer1 Part Number: RN73C1J4K12BTDF; Manufacturer1 Datasheet: \\cern.ch\dfs\Applications\Altium\Datasheets\R0603_Tyco_RN73.pdf; Value: 4k12; Power: 0.063W; TC: ±10ppm; Table: Resistors SMD; Part Number: R0603_4K12_0.1%_0.063W_10PPM; Component Kind: Standard; Component Type: Standard; Designator: Resistor - 0.1%; Library Reference: Resistor - 0.1%; Pin Count: 2; Status: Not recommended; Tolerance: ±0.1%; Manufacturer Part Number: R0603_4K12_0.1%_0.063W_10PPM; Mounted: Yes; Socket: No; SMD: Yes; Manufacturer1 Example: TYCO HOLSWORTHY; Manufacturer1 ComponentHeight: 0.5mm; HelpURL: \\cern.ch\dfs\Applications\Altium\Datasheets\R0603_Tyco_RN73.pdf; Author: CERN DEM JLC; CreateDate: 2007-12-03; LatestRevisionDate: 2008-03-13

## Sheet FMC connector.SchDoc: SAMTEC VITA 57
size 209 x 297 mm; CompanyName: CERN; DrawnBy: GK; Organization: CERN; Address1: European Organization for Nuclear Research; Address2: CH-1211 Geneve 23 - Switzerland; DocumentNumber: 1; Revision: -; SheetNumber: 3; SheetTotal: 9; EDA_Number: EDA-XXXXX-XX-X; Projet: FMC Delay 1ns 4cha; ModifiedBy: -; CheckedDate: -; Title2: Low Pin Count Connector; DivGrp: BE-CO; Designer: GK; ModifiedDate: -
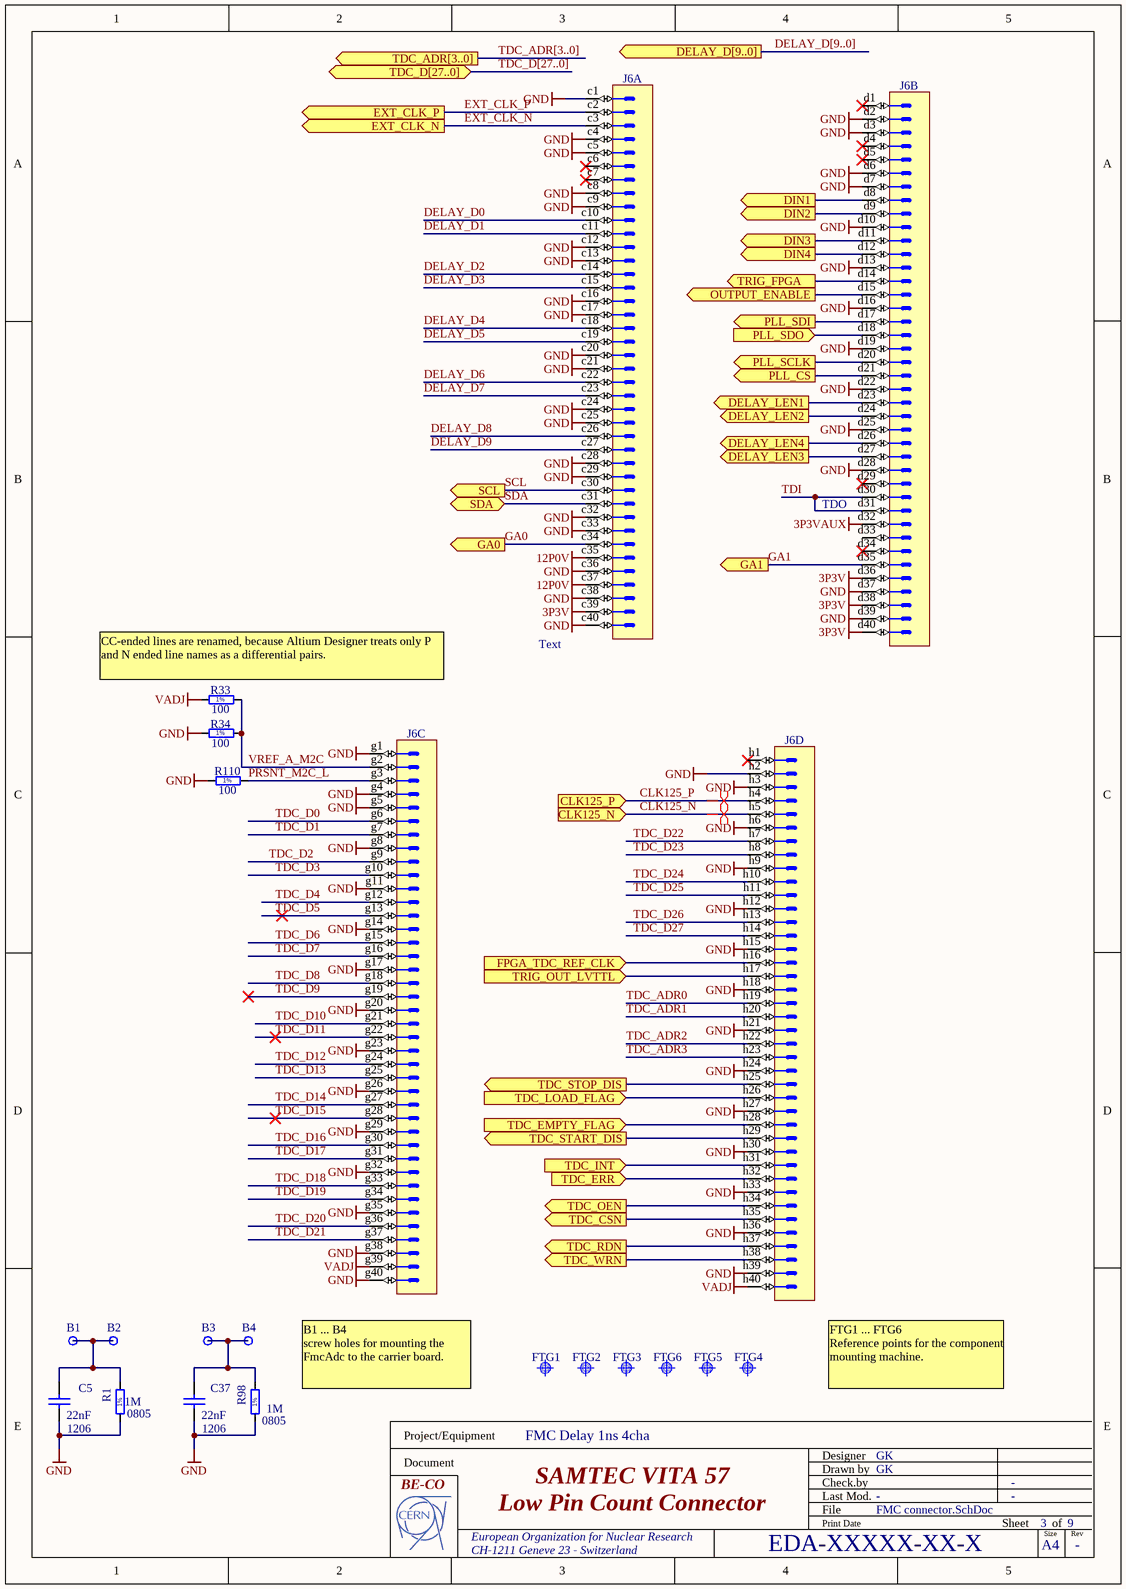
[diagram p2: FMC connector.SchDoc]

### Parts
B1  Plated Hole  [MTG300_600]  (value not drawn)
B2  Plated Hole  [MTG300_600]  (value not drawn)
B3  Plated Hole  [MTG300_600]  (value not drawn)
B4  Plated Hole  [MTG300_600]  (value not drawn)
C5  22nF  Case: 1206  [CAPC3216X140N]
C37  22nF  Case: 1206  [CAPC3216X140N]
FTG1  Use only in PCB  [FIDUCIAL_TOP_S100-200]  (value not drawn)
FTG2  Use only in PCB  [FIDUCIAL_TOP_S100-200]  (value not drawn)
FTG3  Use only in PCB  [FIDUCIAL_TOP_S100-200]  (value not drawn)
FTG4  Use only in PCB  [FIDUCIAL_TOP_S100-200]  (value not drawn)
FTG5  Use only in PCB  [FIDUCIAL_TOP_S100-200]  (value not drawn)
FTG6  Use only in PCB  [FIDUCIAL_TOP_S100-200]  (value not drawn)
J6  VITA 57  [SAMTEC_ASP-127797-01]  (value not drawn)  (parts A,B,C,D of 4)
R1  1M  Case: 0805  [RESC2012X60N]
R33  100  [RESC1608X55N]
R34  100  [RESC1608X55N]
R98  1M  Case: 0805  [RESC2012X60N]
R110  100  [RESC1608X55N]

### Ports
CLK125_N (in), CLK125_P (in), DELAY_D[9..0] (out), DELAY_LEN1 (out), DELAY_LEN2 (out), DELAY_LEN3 (out), DELAY_LEN4 (out), DIN1 (out), DIN2 (out), DIN3 (out), DIN4 (out), EXT_CLK_N (out), EXT_CLK_P (out), FPGA_TDC_REF_CLK (in), GA0 (out), GA1 (out), OUTPUT_ENABLE (out), PLL_CS (out), PLL_SCLK (out), PLL_SDI (out), PLL_SDO (in), SCL (out), SDA (bidir), TDC_ADR[3..0] (out), TDC_CSN (out), TDC_D[27..0] (bidir), TDC_EMPTY_FLAG (in), TDC_ERR (in), TDC_INT (in), TDC_LOAD_FLAG (in), TDC_OEN (out), TDC_RDN (out), TDC_START_DIS (out), TDC_STOP_DIS (out), TDC_WRN (out), TRIG_FPGA (out), TRIG_OUT_LVTTL (in)

### Nets
3P3V: J6.c39 J6.d36 J6.d38 J6.d40  [project net +3.3V]
3P3VAUX: J6.d32
12P0V: J6.c35 J6.c37
GND: C5.2 C37.2 J6.c1 J6.c4 J6.c5 J6.c8 J6.c9 J6.c12 J6.c13 J6.c16 J6.c17 J6.c20 J6.c21 J6.c24 J6.c25 J6.c28 J6.c29 J6.c32 J6.c33 J6.c36 J6.c38 J6.c40 J6.d2 J6.d3 J6.d6 J6.d7 J6.d10 J6.d13 J6.d16 J6.d19 J6.d22 J6.d25 J6.d28 J6.d37 J6.d39 J6.g1 J6.g4 J6.g5 J6.g8 J6.g11 J6.g14 J6.g17 J6.g20 J6.g23 J6.g26 J6.g29 J6.g32 J6.g35 J6.g38 J6.g40 J6.h2 J6.h3 J6.h6 J6.h9 J6.h12 J6.h15 J6.h18 J6.h21 J6.h24 J6.h27 J6.h30 J6.h33 J6.h36 J6.h39 R1.1 R34.1 R98.1 R110.1
VADJ: J6.g39 J6.h40 R33.1
CLK125_N: J6.h5 ; port CLK125_N
CLK125_P: J6.h4 ; port CLK125_P
DELAY_D0: J6.c10
DELAY_D1: J6.c11
DELAY_D2: J6.c14
DELAY_D3: J6.c15
DELAY_D4: J6.c18
DELAY_D5: J6.c19
DELAY_D6: J6.c22
DELAY_D7: J6.c23
DELAY_D8: J6.c26
DELAY_D9: J6.c27
DELAY_LEN1: J6.d23 ; port DELAY_LEN1
DELAY_LEN2: J6.d24 ; port DELAY_LEN2
DELAY_LEN3: J6.d27 ; port DELAY_LEN3
DELAY_LEN4: J6.d26 ; port DELAY_LEN4
DIN1: J6.d8 ; port DIN1
DIN2: J6.d9 ; port DIN2
DIN3: J6.d11 ; port DIN3
DIN4: J6.d12 ; port DIN4
EXT_CLK_N: J6.c3 ; port EXT_CLK_N
EXT_CLK_P: J6.c2 ; port EXT_CLK_P
GA0: J6.c34 ; port GA0
GA1: J6.d35 ; port GA1
PRSNT_M2C_L: J6.g3 R110.2
SCL: J6.c30 ; port SCL
SDA: J6.c31 ; port SDA
TDC_ADR0: J6.h19
TDC_ADR1: J6.h20
TDC_ADR2: J6.h22
TDC_ADR3: J6.h23
TDC_D0: J6.g6
TDC_D1: J6.g7
TDC_D2: J6.g9
TDC_D3: J6.g10
TDC_D4: J6.g12
TDC_D5: J6.g13
TDC_D6: J6.g15
TDC_D7: J6.g16
TDC_D8: J6.g18
TDC_D9: J6.g19
TDC_D10: J6.g21
TDC_D11: J6.g22
TDC_D12: J6.g24
TDC_D13: J6.g25
TDC_D14: J6.g27
TDC_D15: J6.g28
TDC_D16: J6.g30
TDC_D17: J6.g31
TDC_D18: J6.g33
TDC_D19: J6.g34
TDC_D20: J6.g36
TDC_D21: J6.g37
TDC_D22: J6.h7
TDC_D23: J6.h8
TDC_D24: J6.h10
TDC_D25: J6.h11
TDC_D26: J6.h13
TDC_D27: J6.h14
TDI: J6.d30 J6.d31
TRIG_OUT_LVTTL: J6.h17 ; port TRIG_OUT_LVTTL
VREF_A_M2C: J6.g2 R33.2 R34.2
NetB1_1: B1.1 B2.1 C5.1 R1.2
NetB3_1: B3.1 B4.1 C37.1 R98.2
NetIC4_16: J6.d20 ; port PLL_SCLK
NetIC4_17: J6.d21 ; port PLL_CS
NetIC4_22: J6.d17 ; port PLL_SDI
NetIC4_36: J6.h16 ; port FPGA_TDC_REF_CLK
NetIC8_4: J6.h29 ; port TDC_START_DIS
NetIC8_5: J6.h25 ; port TDC_STOP_DIS
NetIC8_13: J6.h38 ; port TDC_WRN
NetIC8_14: J6.h35 ; port TDC_CSN
NetIC8_15: J6.h37 ; port TDC_RDN
NetIC8_63: J6.h34 ; port TDC_OEN
NetIC17_1: J6.d14 ; port TRIG_FPGA
NetJ6_d15: J6.d15 ; port OUTPUT_ENABLE
NetJ6_d18: J6.d18 ; port PLL_SDO
NetJ6_h26: J6.h26 ; port TDC_LOAD_FLAG
NetJ6_h28: J6.h28 ; port TDC_EMPTY_FLAG
NetJ6_h31: J6.h31 ; port TDC_INT
NetJ6_h32: J6.h32 ; port TDC_ERR

Not connected (* = marked no-connect by the designer): J6 c6* c7* d1* d4* d5* d29* d33 d34* h1*

### Buses and harness runs
bus DELAY_D[9..0] = port DELAY_D[9..0]
bus TDC_ADR[3..0] = port TDC_ADR[3..0]
bus TDC_D[27..0] = port TDC_D[27..0]

### Layout directives
differential pair: CLK125_N, CLK125_P

### Notes on the sheet
- (near J6) TDO
- (near J6) Text
- (near R33) CC-ended lines are renamed, because Altium Designer treats only P and N ended line names as a differential pairs.
- B1 ... B4
  screw holes for mounting the FmcAdc to the carrier board.
- FTG1 ... FTG6
  Reference points for the component mounting machine.
- Project/Equipment
- Document
- Designer
- Drawn by
- Check.by
- File
- Last Mod.
- Print Date
- Sheet
- Size
- A4
- of
- Rev
- (in symbol R0603_100R_1%_0.1W_100PPM) 1%
- (in symbol R0805_1M_1%_0.125W_100PPM) 1%

### Library data of the parts
B1-B4 = PLATED_HOLE3.0_PAD6.0: Single Terminal Socket; Part Description: Plated Through Hole: Hole Dia.=3.0mm Pad Dia.=6.0mm; Mounted: No; Table: Pads; Part Number: PLATED_HOLE3.0_PAD6.0; Component Kind: Standard (No BOM); Component Type: Standard (No BOM); Designator: Single Terminal Socket; Library Reference: Single Terminal Socket; Pin Count: 1; Family: Plated Hole; Socket: No; SMD: No; Status: None; ComponentHeight: 0mm; Author: CERN DEM JLC; CreateDate: 26.05.2008; LatestRevisionDate: 26.05.2008; PackageDescription: Plated Through Hole: Hole Dia.=3.0mm Pad Dia.=6.0mm
C5 C37 = CC1206_22NF_200V_10%_X7R: Non-polarised capacitor; Part Description: SMD Multilayer Chip Ceramic Capacitor; Manufacturer: GENERIC; Manufacturer1 Part Number: 223893115641; Voltage: 200V; TC: X7R; Tolerance: ±10%; Table: Capacitors SMD; Part Number: CC1206_22NF_200V_10%_X7R; Component Kind: Standard; Component Type: Standard; Pin Count: 2; Value: 22nF; Status: Preferred; Manufacturer Part Number: CC1206_22NF_200V_10%_X7R; Mounted: Yes; Socket: No; SMD: Yes; HelpURL: \\cern.ch\dfs\Applications\Altium\Datasheets\CC1206_X7R_PHYCOMP.pdf; Author: CERN DEM JLC; CreateDate: 24.08.2009; LatestRevisionDate: 24.08.2009; Manufacturer1 Example: PHYCOMP; Manufacturer1 ComponentHeight: 1.25mm
FTG1-FTG6 = FIDUCIAL_TARGET_S100-200: Fiducial Target; Part Description: Scare Fiducial Target, Top Layer, 1.0mm, Top Sloder 2.0mm, Keepout =2.0mm; Mounted: No; Table: Pads; Part Number: FIDUCIAL_TARGET_S100-200; Component Kind: Standard (No BOM); Component Type: Standard (No BOM); Pin Count: 1; Family: Fiducial; Socket: No; SMD: Yes; Status: None; ComponentHeight: 0mm; Author: CERN DEM JLC; CreateDate: 09.02.2010; LatestRevisionDate: 09.02.2010; PackageDescription: Scare Fiducial Target, Top Layer, 1.0mm, Top Sloder 2.0mm, Keepout =2.0mm
J6 = SAMTEC_ASP-127797-01: Connector VITA 57, 160 Male contacts in 4 row cdgh; Part Description: 160 contacts (4 rows cdgh) Surface Mount Male Connector, VITA 57; Manufacturer: SAMTEC; Manufacturer Part Number: ASP-134488-01; Part Number: SAMTEC_ASP-127797-01; Component Kind: Standard; Component Type: Standard; Pin Count: 160; Family: VITA 57; Mounted: Yes; Socket: No; SMD: Yes; Status: None; ComponentHeight: 6.1mm; HelpURL: \\cern.ch\dfs\Applications\Altium\Datasheets\SAMTEC_ASP-127797-01.pdf; Author: CERN DEM JLC; CreateDate: 2009-09-24; LatestRevisionDate: 2009-09-24; Table: SAMTEC
R1 R98 = R0805_1M_1%_0.125W_100PPM: Resistor - 1%; Part Description: General Purpose Thick Film Chip Resistor; Manufacturer: GENERIC; Manufacturer1 Part Number: NRC10F1004TRF; Manufacturer1 Datasheet: \\cern.ch\dfs\Applications\Altium\Datasheets\R0805_NIC_NRC.pdf; Power: 0.125W; TC: ±100ppm/°C; Table: Resistors SMD; Part Number: R0805_1M_1%_0.125W_100PPM; Component Kind: Standard; Component Type: Standard; Designator: Resistor - 1%; Library Reference: Resistor - 1%; Pin Count: 2; Value: 1M; Status: Preferred; Tolerance: ±1%; Manufacturer Part Number: R0805_1M_1%_0.125W_100PPM; Mounted: Yes; Socket: No; SMD: Yes; Manufacturer1 Example: NIC COMPONENT; Manufacturer1 ComponentHeight: 0.6mm; HelpURL: \\cern.ch\dfs\Applications\Altium\Datasheets\R0805_NIC_NRC.pdf; Author: CERN DEM JLC; CreateDate: 12/3/2007; LatestRevisionDate: 3/13/2008
R33 R34 R110 = R0603_100R_1%_0.1W_100PPM: as R50 on sheet clock_generator; Part Number: R0603_100R_1%_0.1W_100PPM; Component Kind: Standard; Component Type: Standard; Pin Count: 2; Value: 100; Status: Preferred; Tolerance: ±1%; Manufacturer Part Number: R0603_100R_1%_0.1W_100PPM; Case: 0603; Mounted: Yes; Socket: No; SMD: Yes; Manufacturer1 Example: NIC COMPONENT; Manufacturer1 ComponentHeight: 0.55mm; HelpURL: \\cern.ch\dfs\Applications\Altium\Datasheets\R0603_NIC_NRC.pdf; Author: CERN DEM JLC; CreateDate: 2007-12-03; LatestRevisionDate: 2008-03-13